# EAGLE design oscar_shield (EAGLE 9.5.2)
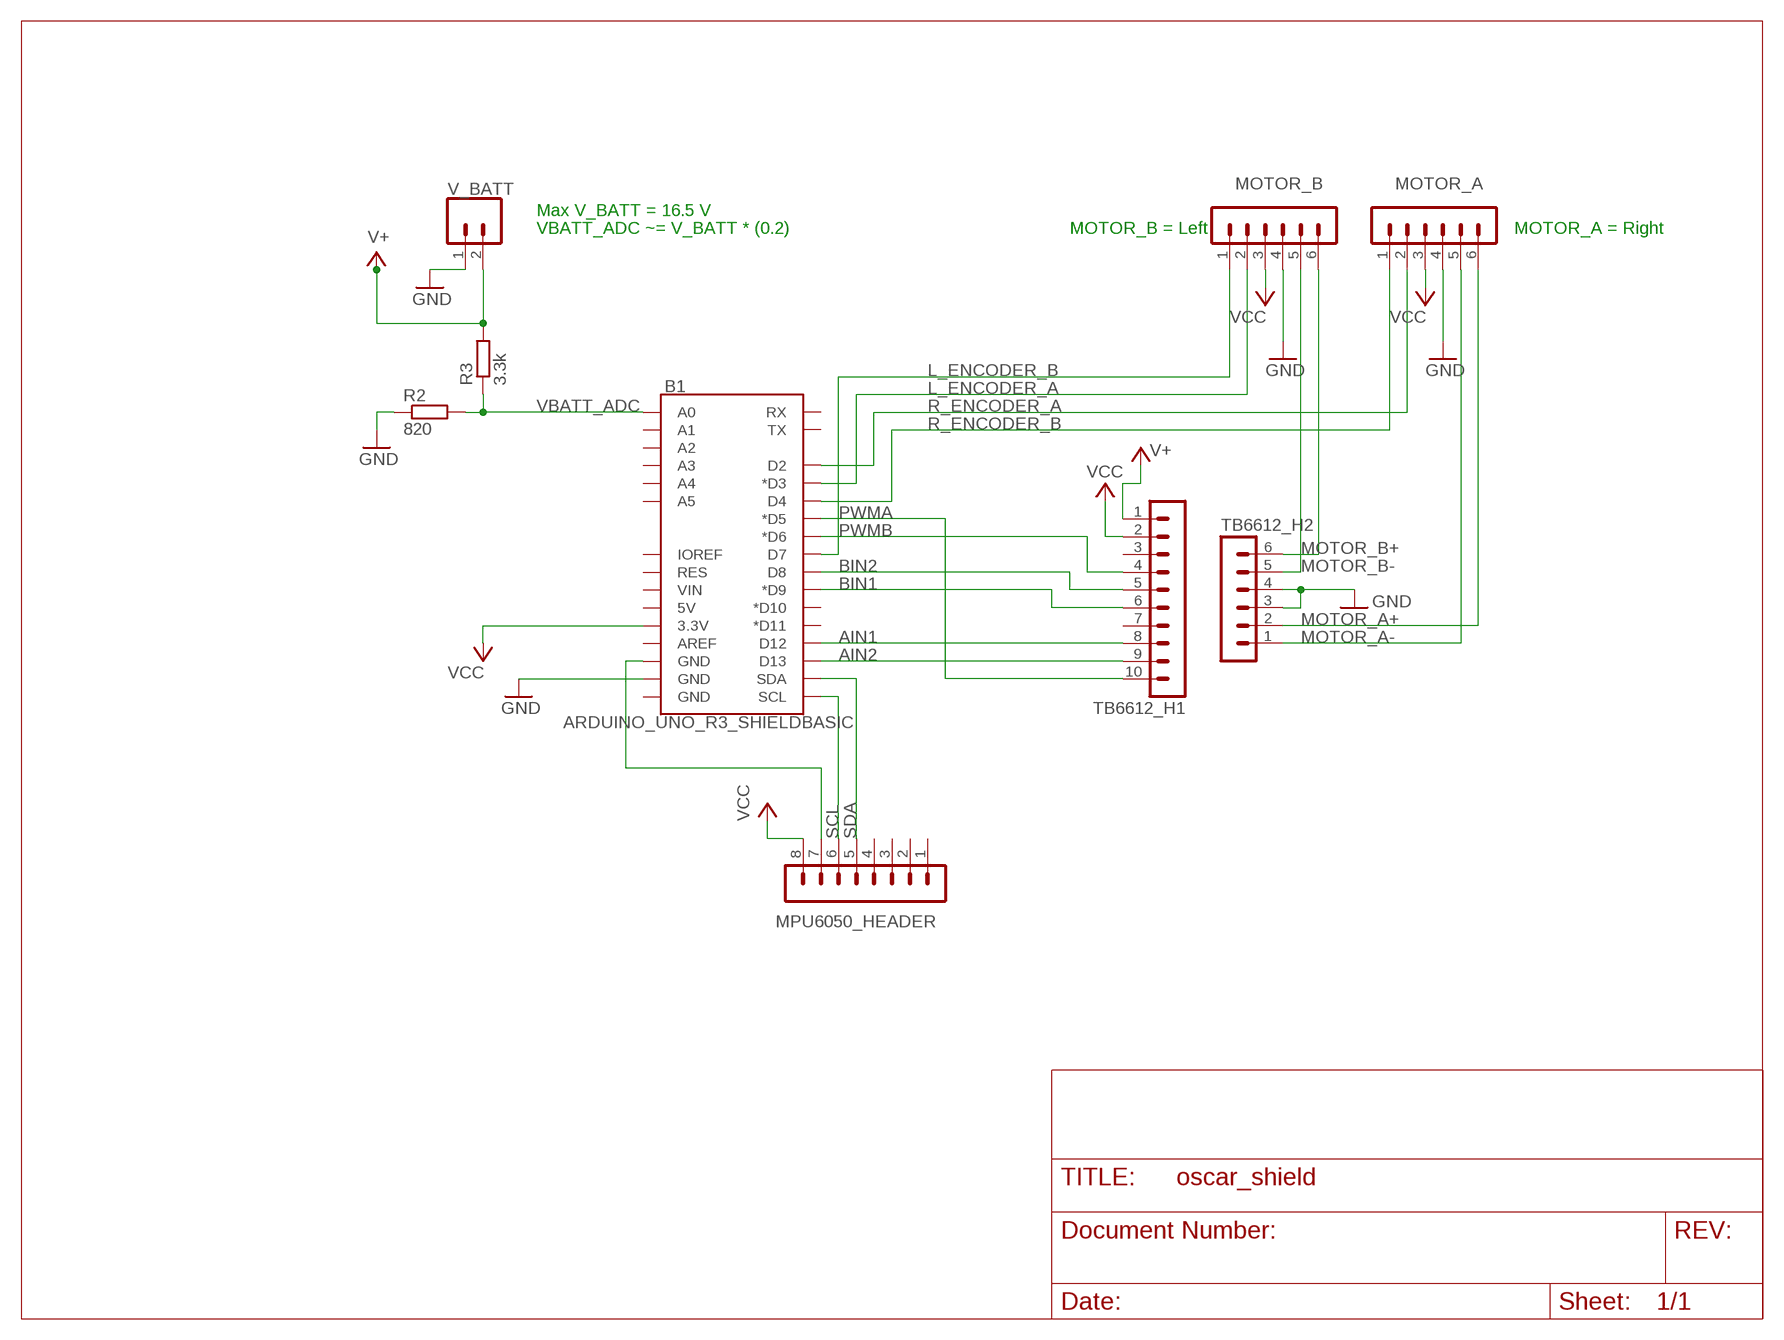
[diagram p0: schematic, sheet 1]

## Parts
B1  ARDUINO_UNO_R3_SHIELDBASIC  [UNO_R3_SHIELD]
MOTOR_A  MA06-1  [MA06-1]
MOTOR_B  MA06-1  [MA06-1]
MPU6050_HEADER  MA08-1  [MA08-1]
R2  820  R-EU_0207/10  [0207/10]
R3  3.3k  R-EU_0207/10  [0207/10]
TB6612_H1  MA10-1  [MA10-1]
TB6612_H2  MA06-1  [MA06-1]
V_BATT  CONN_025MM  [SCREWTERMINAL-5MM-2]

## Nets
AIN1: B1.D12 TB6612_H1.8
AIN2: B1.D13 TB6612_H1.9
BIN1: B1.D9(*D9) TB6612_H1.6
BIN2: B1.D8 TB6612_H1.5
GND: B1.GND@1(GND) MOTOR_A.4 MOTOR_B.4 R2.1 TB6612_H2.3 TB6612_H2.4 V_BATT.1
L_ENCODER_A: B1.D3(*D3) MOTOR_B.2
L_ENCODER_B: B1.D7 MOTOR_B.1
MOTOR_A+: MOTOR_A.6 TB6612_H2.2
MOTOR_A-: MOTOR_A.5 TB6612_H2.1
MOTOR_B+: MOTOR_B.6 TB6612_H2.6
MOTOR_B-: MOTOR_B.5 TB6612_H2.5
N$3: B1.GND@2(GND) MPU6050_HEADER.7
PWMA: B1.D5(*D5) TB6612_H1.10
PWMB: B1.D6(*D6) TB6612_H1.4
R_ENCODER_A: B1.D2 MOTOR_A.2
R_ENCODER_B: B1.D4 MOTOR_A.1
SCL: B1.SCL MPU6050_HEADER.6
SDA: B1.SDA MPU6050_HEADER.5
V+: R3.2 TB6612_H1.1 V_BATT.2
VBATT_ADC: B1.A0 R2.2 R3.1
VCC: B1.3.3V MOTOR_A.3 MOTOR_B.3 MPU6050_HEADER.8 TB6612_H1.2
Unconnected: B1.5V B1.A1 B1.A2 B1.A3 B1.A4 B1.A5 B1.AREF B1.D10(*D10) B1.D11(*D11) B1.GND@0(GND) B1.IOREF B1.RES B1.RX B1.TX B1.VIN MPU6050_HEADER.1 MPU6050_HEADER.2 MPU6050_HEADER.3 MPU6050_HEADER.4 TB6612_H1.3 TB6612_H1.7

## Notes on the sheet
- Max V_BATT = 16.5 V
- VBATT_ADC ~= V_BATT * (0.2) | MOTOR_B = Left | MOTOR_A = Right

## Library data of the parts
B1 = SparkFun-Boards:ARDUINO_UNO_R3_SHIELD: Arduino R3 Shield Footprint Shield form compatible with the Arduino Uno R3. SparkFun Products: MG2639 Cellular Shield <https://www.sparkfun.com/products/13120> MIDI Shield <https://www.sparkfun.com/products/12898> R3 Stackable Headers Kit <https://www.sparkfun.com/products/11417>
MOTOR_A MOTOR_B TB6612_H2 = con-lstb:MA06-1: PIN HEADER; OC_FARNELL: unknown; OC_NEWARK: unknown
MPU6050_HEADER = con-lstb:MA08-1: PIN HEADER; OC_FARNELL: unknown; OC_NEWARK: unknown
R2 R3 = rcl:R-EU_: RESISTOR, European symbol; SPICEPREFIX: R
TB6612_H1 = con-lstb:MA10-1: PIN HEADER; OC_FARNELL: unknown; OC_NEWARK: unknown
V_BATT = SparkFun-Connectors:CONN_02: Multi connection point. Often used as Generic Header-pin footprint for 0.1 inch spaced/style header connections On any of the 0.1 inch spaced packages, you can populate with these: Break Away Headers - Straight <https://www.sparkfun.com/products/116> (PRT-00116) Break Away Male Headers - Right Angle <https://www.sparkfun.com/products/553> (PRT-00553) Female Headers <https://www.sparkfun.com/products/115> (PRT-00115) Break Away Headers - Machine Pin <https://www.sparkfun.com/products/117> (PRT-00117) Break Away Female Headers - Swiss Machine Pin <https://www.sparkfun.com/products/743> (PRT-00743) For SCREWTERMINALS and SPRING TERMINALS visit here: Screw Terimnals on SparkFun.com <https://www.sparkfun.com/search/results?term=Screw+Terminals> (5mm/3.5mm/2.54mm spacing) This device is also useful as a general connection point to wire up your design to another part of your project. Our various solder wires solder well into these plated through hole pads. Hook-Up Wire - Assortment (Stranded, 22 AWG) <https://www.sparkfun.com/products/11375> (PRT-11375) Hook-Up Wire - Assortment (Solid Core, 22 AWG) <https://www.sparkfun.com/products/11367> (PRT-11367) View the entire wire category on our website here <https://www.sparkfun.com/categories/141> Special notes: Molex polarized connector foot print use with: PRT-08233 with associated crimp pins and housings. 2.54_SCREWTERM for use with PRT-10571. 3.5mm Screw Terminal footprints for PRT-08084 5mm Screw Terminal footprints for use with PRT-08432; SF_SKU: PRT-08432

## Board
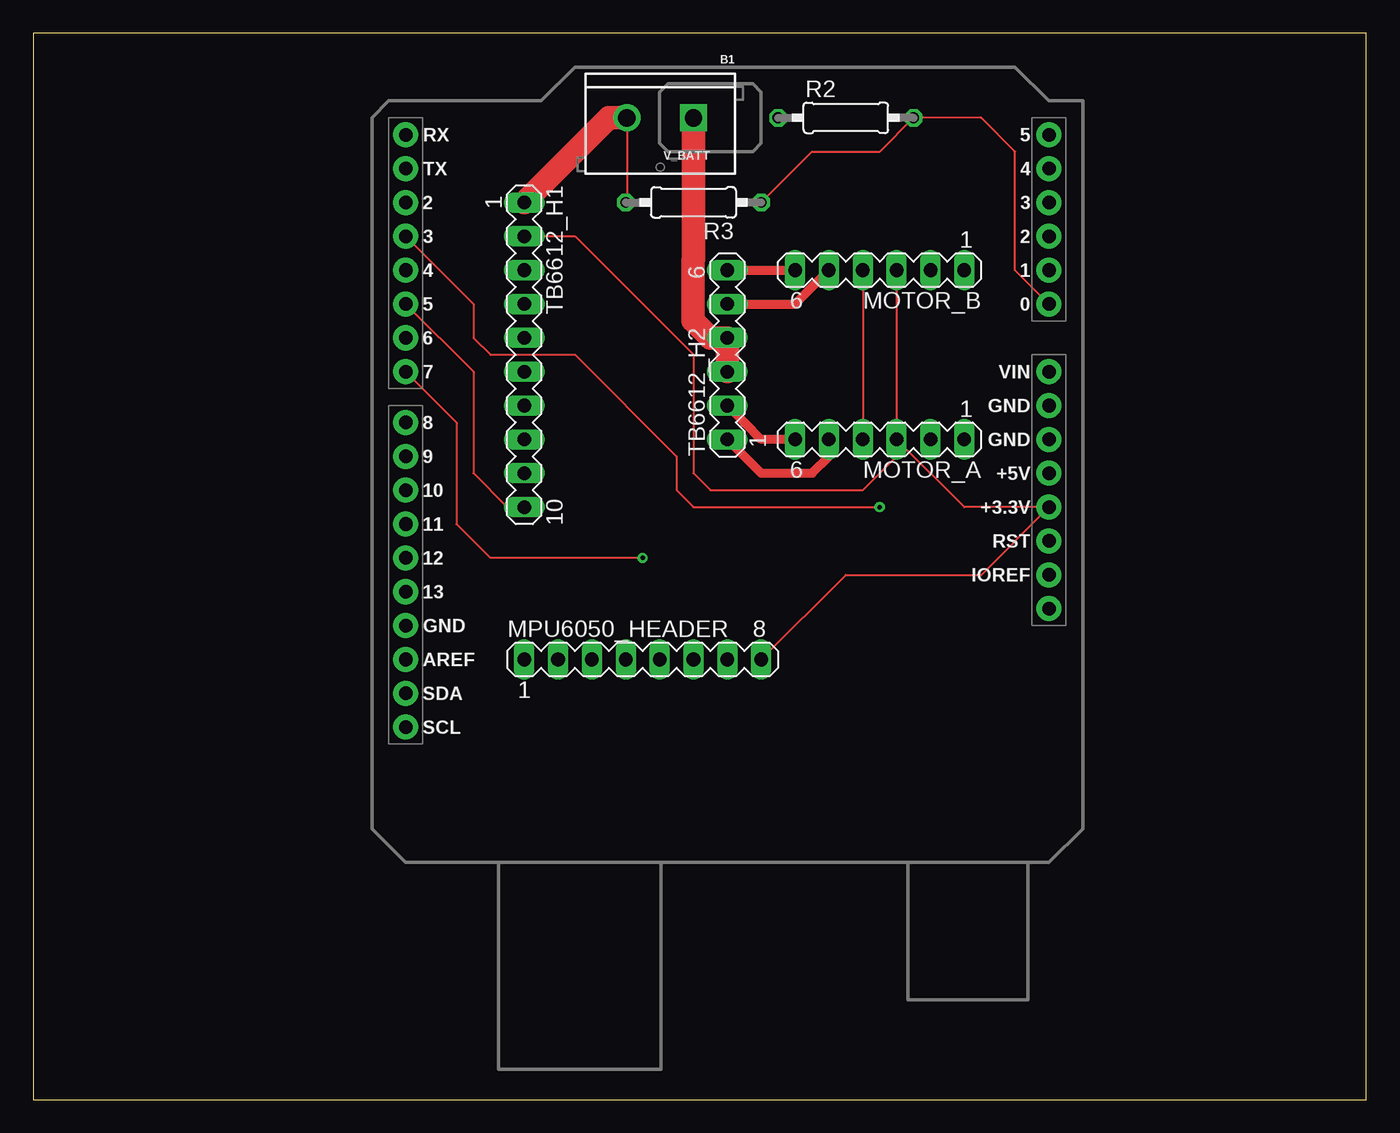
[diagram p1: board, top side]
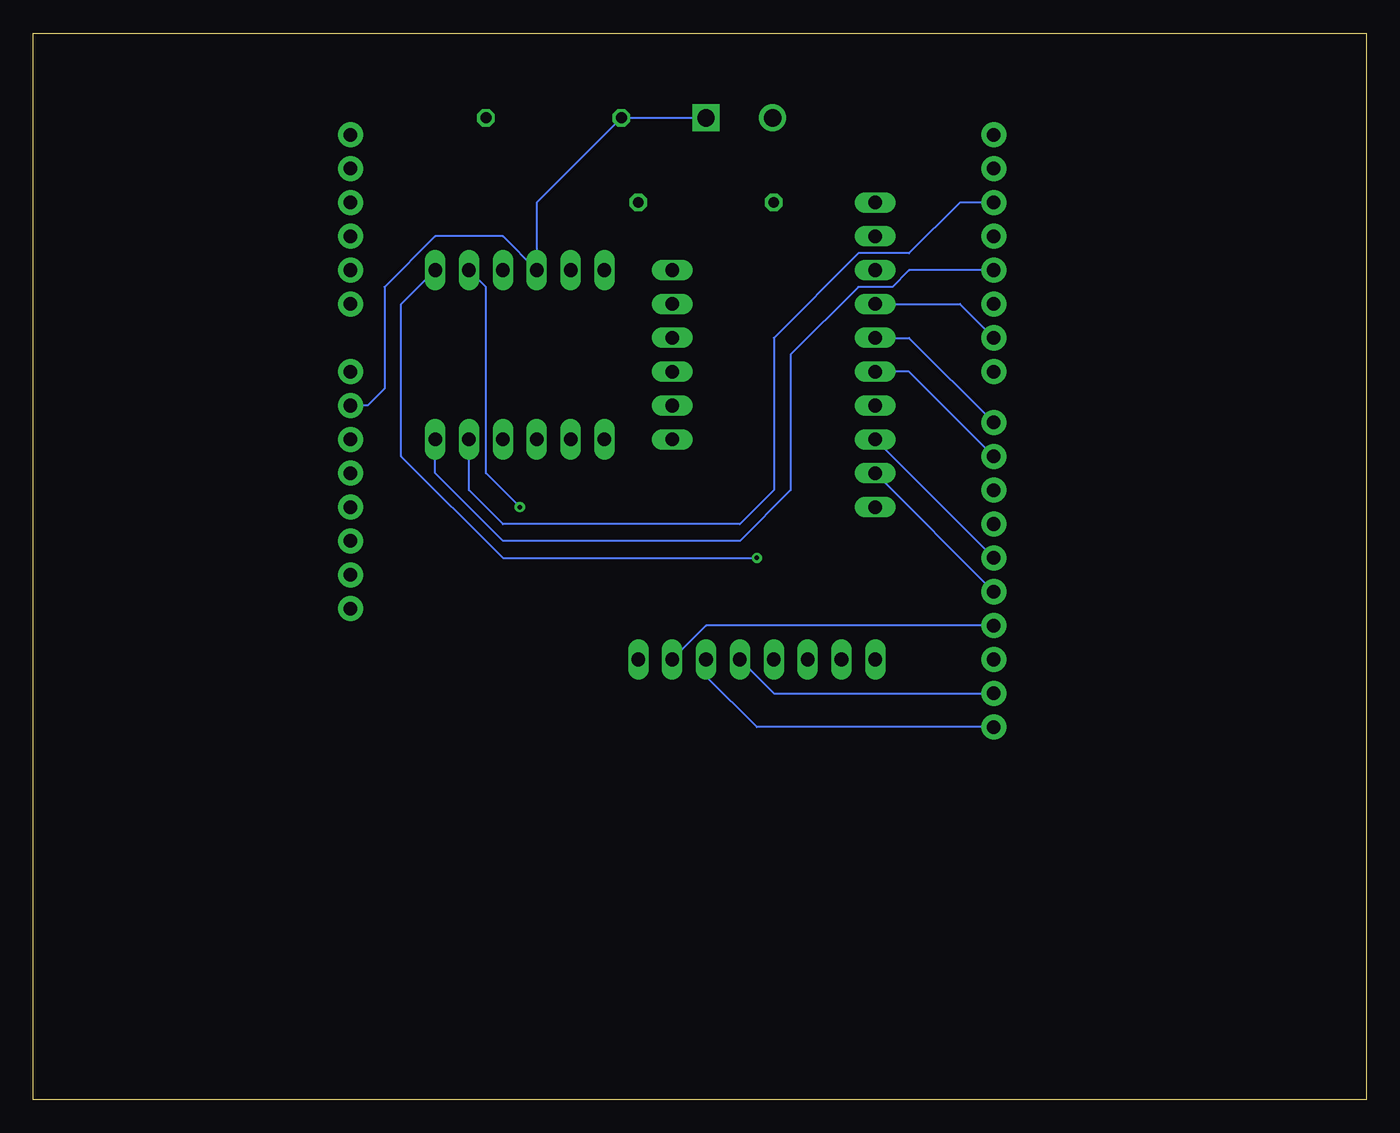
[diagram p2: board, bottom side, seen from below]

Size 100 x 80 mm. Coordinates in mm from the lower left corner, seen from the top.
Outline: 0,0 100,0 100,80 0,80 0,0
Copper layers (1*16): Top 0.035mm / dielectric 1.5mm / Bottom 0.035mm
Design rules "default": minimum track width 6mil, minimum drill 0.35mm, track to track 6mil, track to pad 6mil, pad to pad 6mil, via to via 6mil, smd to smd 6mil, copper to edge 40mil, drill to drill 6mil, minimum pad ring 10mil, minimum via ring 8mil, stop-mask expansion 4mil, vias tented up to drill 0mil, thermal gap 10mil

### Footprints (pad centres in the part's own frame; a part is rotated, then mirrored left to right if it is on the bottom)
UNO_R3_SHIELD = drill 1.016 pad 1.88: 3.3V 24.13,-2.54; 5V 24.13,0; A0 24.13,12.7; A1 24.13,15.24; A2 24.13,17.78; A3 24.13,20.32; A4 24.13,22.86; A5 24.13,25.4; AREF -24.13,-13.97; D2 -24.13,20.32; D3 -24.13,17.78; D4 -24.13,15.24; D5 -24.13,12.7; D6 -24.13,10.16; D7 -24.13,7.62; D8 -24.13,3.81; D9 -24.13,1.27; D10 -24.13,-1.27; D11 -24.13,-3.81; D12 -24.13,-6.35; D13 -24.13,-8.89; GND@0 24.13,2.54; GND@1 24.13,5.08; GND@2 -24.13,-11.43; IOREF 24.13,-7.62; NC 24.13,-10.16; RES 24.13,-5.08; RX -24.13,25.4; SCL -24.13,-19.05; SDA -24.13,-16.51; TX -24.13,22.86; VIN 24.13,7.62
MA06-1 = drill 1.016 long: 1 -6.35,0; 2 -3.81,0; 3 -1.27,0; 4 1.27,0; 5 3.81,0; 6 6.35,0
MA08-1 = drill 1.016 long: 1 -8.89,0; 2 -6.35,0; 3 -3.81,0; 4 -1.27,0; 5 1.27,0; 6 3.81,0; 7 6.35,0; 8 8.89,0
0207/10 = drill 0.813 octagon: 1 -5.08,0; 2 5.08,0
MA10-1 = drill 1.016 long: 1 -11.43,0; 2 -8.89,0; 3 -6.35,0; 4 -3.81,0; 5 -1.27,0; 6 1.27,0; 7 3.81,0; 8 6.35,0; 9 8.89,0; 10 11.43,0
SCREWTERMINAL-5MM-2 = drill 1.3 pad 2.032 square: 1 0,0 | drill 1.3 pad 2.032: 2 5,0

### Placement (x,y rotation side)
B1  52.07,46.99 0 top
MOTOR_A  63.5,49.53 180 top
MOTOR_B  63.5,62.23 180 top
MPU6050_HEADER  45.72,33.02 0 top
R2  60.96,73.66 0 top
R3  49.53,67.31 180 top
TB6612_H1  36.83,55.88 270 top
TB6612_H2  52.07,55.88 90 top
V_BATT  49.53,73.66 180 top

### Tracks (layer width: path | path; a pad name or v marks a point on that pad's centre or on a via)
AIN1
  Bottom 0.152: TB6612_H1.8 B1.D12
AIN2
  Bottom 0.152: B1.D13 TB6612_H1.9
BIN1
  Bottom 0.152: B1.D9 34.29,54.61 TB6612_H1.6
BIN2
  Bottom 0.152: TB6612_H1.5 34.29,57.15 B1.D8
GND
  Top 0.152: MOTOR_B.4 MOTOR_A.4
  Top 1.778: TB6612_H2.3 TB6612_H2.4 50.8,57.15 49.51,58.45 49.51,62.98 49.53,63 V_BATT.1
  Bottom 0.152: V_BATT.1 R2.1 62.23,67.31 MOTOR_B.4 64.77,64.77 69.85,64.77 73.66,60.96 73.66,53.34 74.93,52.07 B1.GND@1 | 62.23,50.8 MOTOR_A.4
L_ENCODER_A  (via drill 0.35)
  Top 0.152: B1.D3 33.02,59.69 33.02,57.15 34.29,55.88 40.64,55.88 48.26,48.26 48.26,45.72 49.53,44.45 v63.5,44.45
  Bottom 0.152: v63.5,44.45 66.04,46.99 66.04,60.96 MOTOR_B.2
L_ENCODER_B  (via drill 0.35)
  Top 0.152: B1.D7 31.75,50.8 31.75,43.18 34.29,40.64 v45.72,40.64
  Bottom 0.152: v45.72,40.64 64.77,40.64 72.39,48.26 72.39,59.69 MOTOR_B.1
MOTOR_A+
  Top 0.686: 53.35,50.79 | 53.35,50.79 TB6612_H2.2 | MOTOR_A.6 54.61,49.53 53.35,50.79
MOTOR_A-
  Top 0.686: TB6612_H2.1 54.61,46.99 58.42,46.99 59.69,48.26 MOTOR_A.5
MOTOR_B+
  Top 0.686: TB6612_H2.6 MOTOR_B.6
MOTOR_B-
  Top 0.686: 58.41,60.95 | 58.41,60.95 MOTOR_B.5 | TB6612_H2.5 57.15,59.69 58.41,60.95
N$3
  Bottom 0.152: B1.GND@2 49.53,35.56 MPU6050_HEADER.7
PWMA
  Top 0.152: TB6612_H1.10 35.56,44.45 33.02,46.99 33.02,54.61 B1.D5
PWMB
  Bottom 0.152: B1.D6 30.48,59.69 TB6612_H1.4
R_ENCODER_A
  Bottom 0.152: B1.D2 30.48,67.31 34.29,63.5 38.1,63.5 44.45,57.15 44.45,45.72 46.99,43.18 64.77,43.18 67.31,45.72 MOTOR_A.2
R_ENCODER_B
  Bottom 0.152: B1.D4 34.29,62.23 35.56,60.96 38.1,60.96 43.18,55.88 43.18,45.72 46.99,41.91 64.77,41.91 69.85,46.99 MOTOR_A.1
SCL
  Bottom 0.152: B1.SCL 45.72,27.94 49.53,31.75 MPU6050_HEADER.6
SDA
  Top 0.152: 46.99,34.29 MPU6050_HEADER.5
  Bottom 0.152: MPU6050_HEADER.5 44.45,30.48 B1.SDA
V+
  Top 0.152: V_BATT.2 44.53,67.39 R3.2
  Top 1.778: TB6612_H1.1 43.18,73.66 V_BATT.2
VBATT_ADC
  Top 0.152: R3.1 58.42,71.12 63.5,71.12 R2.2 71.12,73.66 73.66,71.12 73.66,62.23 B1.A0
VCC
  Top 0.152: MOTOR_B.3 MOTOR_A.3 | TB6612_H1.2 40.64,64.77 49.53,55.88 49.53,46.99 50.8,45.72 62.23,45.72 64.77,48.26 MOTOR_A.3 | MOTOR_A.3 69.85,44.45 B1.3.3V 71.12,39.37 60.96,39.37 MPU6050_HEADER.8
  Bottom 0.152: TB6612_H1.2 38.1,64.77